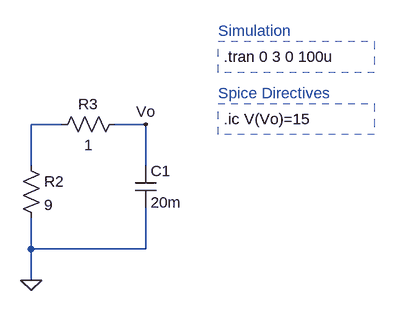
[diagram p0: schematic Switch_Option_2.asc]
Switch_Option_2.asc, the LTspice schematic file:
Version 4
SHEET 1 1532 760
WIRE 400 192 352 192
WIRE 528 192 480 192
WIRE 352 256 352 192
WIRE 528 256 528 192
WIRE 352 384 352 336
WIRE 528 384 528 320
WIRE 528 384 352 384
WIRE 352 432 352 384
FLAG 528 192 Vo
FLAG 352 432 0
SYMBOL res 336 240 R0
SYMATTR InstName R2
SYMATTR Value 9
SYMBOL res 496 176 R90
WINDOW 0 0 56 VBottom 2
WINDOW 3 32 56 VTop 2
SYMATTR InstName R3
SYMATTR Value 1
SYMBOL cap 512 256 R0
SYMATTR InstName C1
SYMATTR Value 20m
TEXT 640 48 Left 2 ;Simulation
TEXT 648 88 Left 2 !.tran 0 3 0 100u
TEXT 640 144 Left 2 ;Spice Directives
TEXT 648 184 Left 2 !.ic V(Vo)=15
RECTANGLE Normal 880 112 640 64 2
RECTANGLE Normal 880 208 640 160 2

The netlist it stands for:
* Switch_Option_2.asc
R2 N001 0 9
R3 Vo N001 1
C1 Vo 0 20m
* Simulation
.tran 0 3 0 100u
* Spice Directives
.ic V(Vo)=15
.backanno
.end